# Altium schematic sheet wlpkt1_main.SchDoc: Schemat główny
size A4; DocumentNumber: 1; SheetNumber: 1; SheetTotal: 5; LotOfPieces: 1
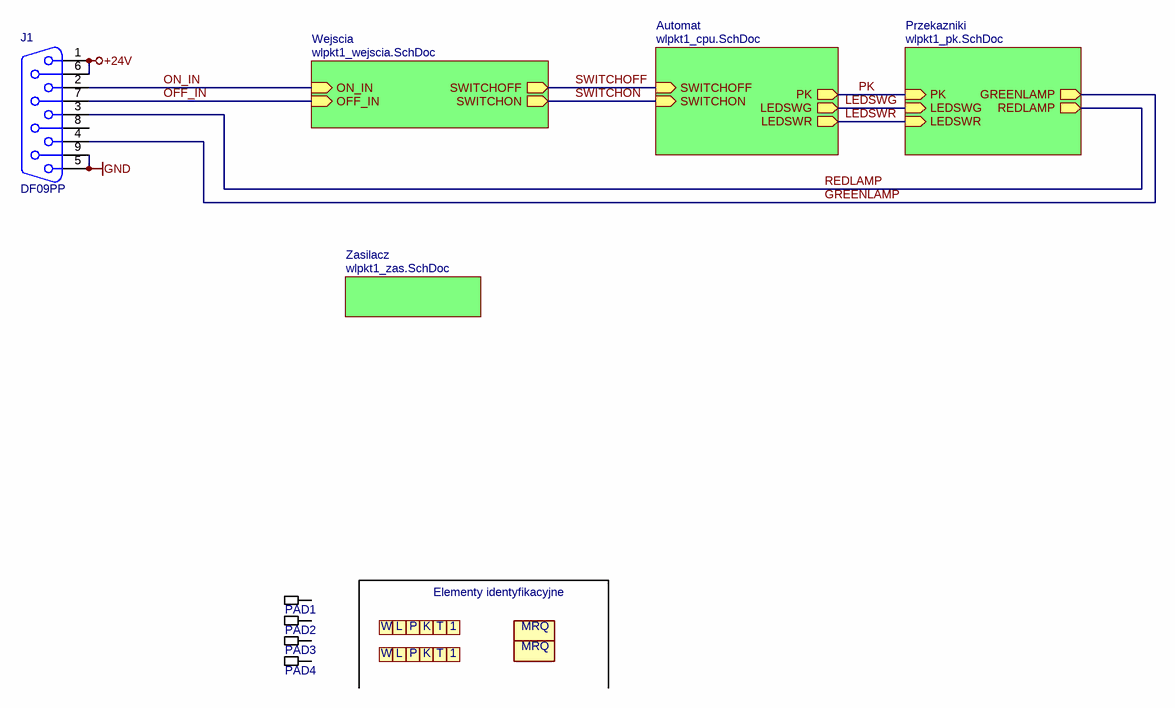
[diagram p0: wlpkt1_main.SchDoc]

## Parts
J1  DF09PP  [DB9/F]
LETTER1  LETTERC_W  [LETTERC_W_60_10]  (value not drawn)  (no BOM)
LETTER2  LETTERC_L  [LETTERC_L_60_10]  (value not drawn)  (no BOM)
LETTER3  LETTERC_P  [LETTERC_P_60_10]  (value not drawn)  (no BOM)
LETTER4  LETTERC_K  [LETTERC_K_60_10]  (value not drawn)  (no BOM)
LETTER5  LETTERC_T  [LETTERC_T_60_10]  (value not drawn)  (no BOM)
LETTER6  LETTER_1_60_10  [LETTER_1_60_10]  (value not drawn)  (no BOM)
LETTER7  LETTERC_W  [LETTERC_W_60_10]  (value not drawn)  (no BOM)
LETTER8  LETTERC_L  [LETTERC_L_60_10]  (value not drawn)  (no BOM)
LETTER9  LETTERC_P  [LETTERC_P_60_10]  (value not drawn)  (no BOM)
LETTER10  LETTERC_K  [LETTERC_K_60_10]  (value not drawn)  (no BOM)
LETTER11  LETTERC_T  [LETTERC_T_60_10]  (value not drawn)  (no BOM)
LETTER12  LETTER_1_60_10  [LETTER_1_60_10]  (value not drawn)  (no BOM)
LOGO1  MRQ_2_8  [MRQ_2_8]  (value not drawn)  (no BOM)
LOGO2  MRQ_2_8  [MRQ_2_8]  (value not drawn)  (no BOM)
PAD1  PAD3_5MM  [PAD3_5MM]  (value not drawn)  (no BOM)
PAD2  PAD3_5MM  [PAD3_5MM]  (value not drawn)  (no BOM)
PAD3  PAD3_5MM  [PAD3_5MM]  (value not drawn)  (no BOM)
PAD4  PAD3_5MM  [PAD3_5MM]  (value not drawn)  (no BOM)

## Sub-sheets
Automat = wlpkt1_cpu.SchDoc: SWITCHOFF (in), SWITCHON (in), PK (out), LEDSWG (out), LEDSWR (out)
Przekazniki = wlpkt1_pk.SchDoc: PK (in), LEDSWG (in), LEDSWR (in), GREENLAMP (out), REDLAMP (out)
Wejscia = wlpkt1_wejscia.SchDoc: ON_IN (in), SWITCHOFF (out), SWITCHON (out), OFF_IN (in)
Zasilacz = wlpkt1_zas.SchDoc: no entries

## Nets
+24V: J1.1 J1.6
GND: J1.5 J1.9
GREENLAMP: J1.4 ; sheet Przekazniki/GREENLAMP
LEDSWG: sheet Automat/LEDSWG, sheet Przekazniki/LEDSWG
LEDSWR: sheet Automat/LEDSWR, sheet Przekazniki/LEDSWR
OFF_IN: J1.7 ; sheet Wejscia/OFF_IN
ON_IN: J1.2 ; sheet Wejscia/ON_IN
PK: sheet Automat/PK, sheet Przekazniki/PK
REDLAMP: J1.3 ; sheet Przekazniki/REDLAMP
SWITCHOFF: sheet Wejscia/SWITCHOFF, sheet Automat/SWITCHOFF
SWITCHON: sheet Wejscia/SWITCHON, sheet Automat/SWITCHON

Not connected (* = marked no-connect by the designer): J1 8; PAD1 1; PAD2 1; PAD3 1; PAD4 1

## Notes on the sheet
- Elementy identyfikacyjne
- Jeżeli nie wskazano inaczej, tolerancja rezystorów wynosi 1%
- Nazwa modułu (skrót)
- Słowna nazwa modułu
- Rozmiar arkusza
- A4
- Projektował
- Rysował
- Podpis
- Data:
- Ark.
- z
- Wer.
- (in symbol NOB5) MRQ
- (in symbol NOB7) 1
- (in symbol NOB34) W
- (in symbol NOB35) L
- (in symbol NOB36) P
- (in symbol NOB37) K
- (in symbol NOB38) T

## Library data of the parts
J1 = Con312: Kod: Con312; ID: 312; Descript: Gniazdo; D-Sub; PIN:9; żeńskie; proste; THT; złocony; Typ5: DS1034-09FUNSISS; Replacement: bd; Value: DF09PP; Price5: 2; DateOfPrice5: 2020-11-08; Supplier5: tme.pl; Reference5: DF09PP; Manufacturer5: Connfly
LETTER1 LETTER7 = NOB34: Kod: NOB34; ID: 34; Descript: bd; Value: LETTERC_W
LETTER2 LETTER8 = NOB35: Kod: NOB35; ID: 35; Descript: bd; Value: LETTERC_L
LETTER3 LETTER9 = NOB36: Kod: NOB36; ID: 36; Descript: bd; Value: LETTERC_P
LETTER4 LETTER10 = NOB37: Kod: NOB37; ID: 37; Descript: bd; Value: LETTERC_K
LETTER5 LETTER11 = NOB38: Kod: NOB38; ID: 38; Descript: bd; Value: LETTERC_T
LETTER6 LETTER12 = NOB7: Kod: NOB7; ID: 7; Descript: bd; Value: LETTER_1_60_10
LOGO1 LOGO2 = NOB5: Kod: NOB5; ID: 5; Descript: bd; Value: MRQ_2_8
PAD1-PAD4 = Oth106: PartIdx: Oth106; Identyfikator: 106; Descript: bd; Value: PAD3_5MM; DateOfPrice5: 01-01-2010; ID: 106; Manufacturer5: bd; Price5: -1; Reference5: bd; Supplier5: bd; Typ5: bd